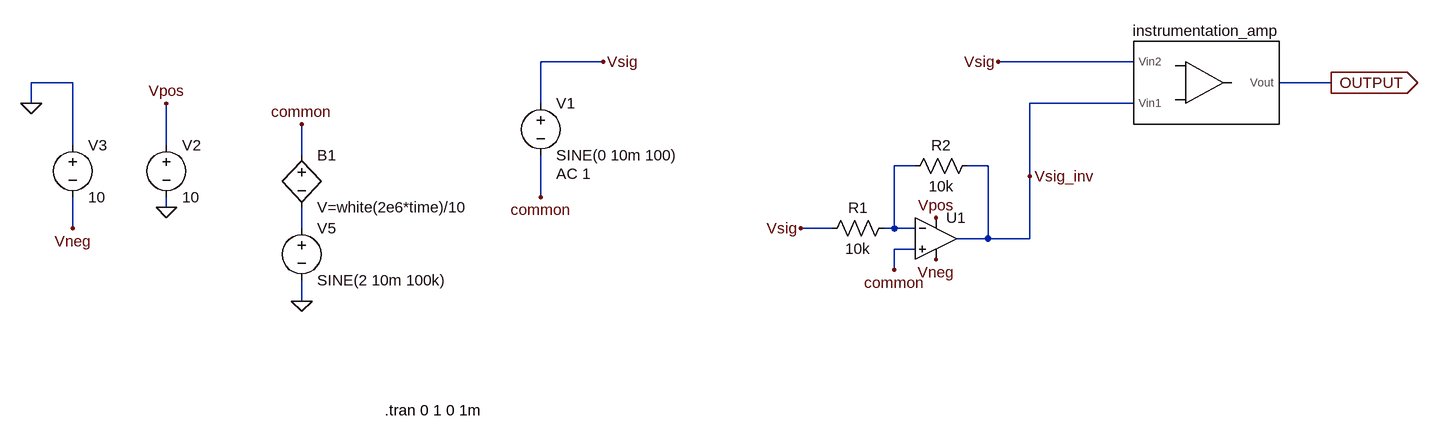
[diagram p0: schematic test_setup.asc]
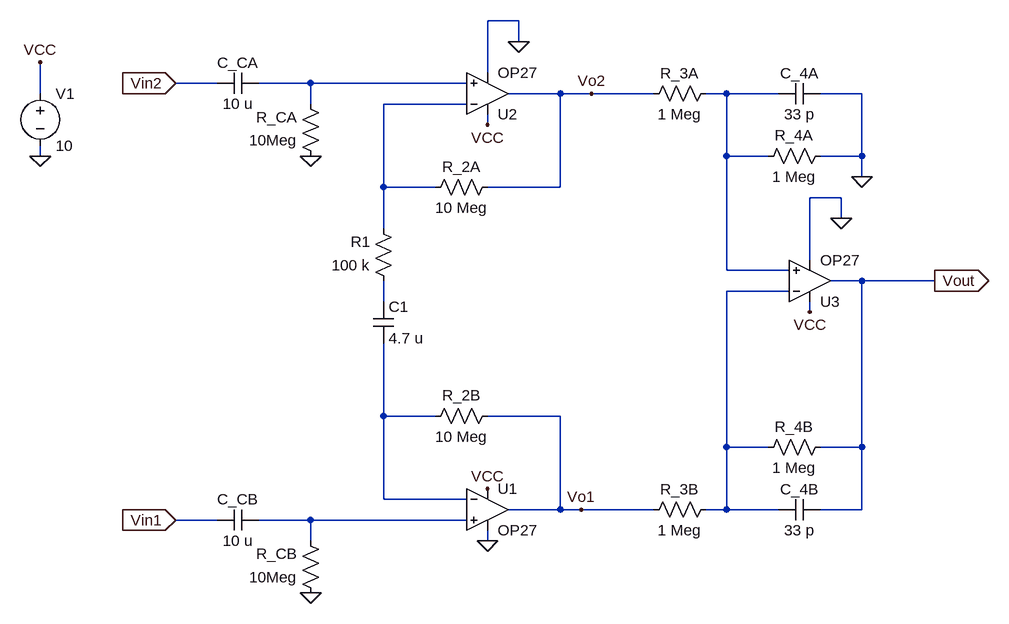
[diagram p1: sub-circuit instrumentation_amplifier.asc]
test_setup.asc, the LTspice schematic file:
Version 4.1
SHEET 1 1020 680
WIRE -592 16 -688 16
WIRE 224 16 16 16
WIRE -1408 48 -1472 48
WIRE 528 48 448 48
WIRE -1472 80 -1472 48
WIRE -688 80 -688 16
WIRE 224 80 64 80
WIRE -1408 144 -1408 48
WIRE -1264 144 -1264 80
WIRE -1056 160 -1056 112
WIRE -112 176 -144 176
WIRE 0 176 -32 176
WIRE 64 192 64 80
WIRE -688 224 -688 160
WIRE -1264 240 -1264 224
WIRE -1408 272 -1408 224
WIRE -1056 272 -1056 240
WIRE -240 272 -288 272
WIRE -144 272 -144 176
WIRE -144 272 -160 272
WIRE -112 272 -144 272
WIRE 0 288 0 176
WIRE 0 288 -48 288
WIRE 64 288 64 192
WIRE 64 288 0 288
WIRE -112 304 -144 304
WIRE -144 336 -144 304
WIRE -1056 384 -1056 352
FLAG -592 16 Vsig
FLAG -288 272 Vsig
FLAG 16 16 Vsig
FLAG -1264 80 Vpos
FLAG -80 256 Vpos
FLAG -1264 240 0
FLAG -1472 80 0
FLAG -1408 272 Vneg
FLAG -80 320 Vneg
FLAG 528 48 OUTPUT
IOPIN 528 48 Out
FLAG 64 192 Vsig_inv
FLAG -1056 112 common
FLAG -688 224 common
FLAG -144 336 common
FLAG -1056 384 0
SYMBOL instrumentation_amplifier 128 -64 R0
SYMATTR InstName instrumentation_amp
SYMBOL voltage -688 64 R0
WINDOW 123 24 124 Left 2
WINDOW 39 0 0 Left 0
SYMATTR InstName V1
SYMATTR Value SINE(0 10m 100)
SYMATTR Value2 AC 1
SYMBOL res -144 256 R90
WINDOW 0 0 56 VBottom 2
WINDOW 3 32 56 VTop 2
SYMATTR InstName R1
SYMATTR Value 10k
SYMBOL res -16 160 R90
WINDOW 0 0 56 VBottom 2
WINDOW 3 32 56 VTop 2
SYMATTR InstName R2
SYMATTR Value 10k
SYMBOL OpAmps\\UniversalOpAmp2 -80 288 R0
SYMATTR InstName U1
SYMBOL voltage -1264 128 R0
SYMATTR InstName V2
SYMATTR Value 10
SYMBOL voltage -1408 128 R0
SYMATTR InstName V3
SYMATTR Value 10
SYMBOL voltage -1056 256 R0
WINDOW 123 0 0 Left 0
WINDOW 39 0 0 Left 0
SYMATTR InstName V5
SYMATTR Value SINE(2 10m 100k)
SYMBOL bv -1056 144 R0
SYMATTR InstName B1
SYMATTR Value V=white(2e6*time)/10
TEXT -928 552 Left 2 !.tran 0 1 0 1m

instrumentation_amplifier.asc, the sub-circuit schematic file:
Version 4.1
SHEET 1 964 692
WIRE 192 -208 144 -208
WIRE 192 -176 192 -208
WIRE 144 -128 144 -208
WIRE -272 -112 -336 -112
WIRE -128 -112 -208 -112
WIRE 112 -112 -128 -112
WIRE -544 -96 -544 -144
WIRE 256 -96 176 -96
WIRE 304 -96 256 -96
WIRE 400 -96 304 -96
WIRE 512 -96 480 -96
WIRE 592 -96 512 -96
WIRE 720 -96 656 -96
WIRE -128 -80 -128 -112
WIRE 112 -80 -16 -80
WIRE 144 -48 144 -64
WIRE -544 0 -544 -16
WIRE 512 0 512 -96
WIRE 576 0 512 0
WIRE 720 0 720 -96
WIRE 720 0 656 0
WIRE 720 32 720 0
WIRE -16 48 -16 -80
WIRE 64 48 -16 48
WIRE 256 48 256 -96
WIRE 256 48 144 48
WIRE 688 64 640 64
WIRE 688 96 688 64
WIRE -16 112 -16 48
WIRE 640 160 640 64
WIRE 512 176 512 0
WIRE 608 176 512 176
WIRE 720 192 672 192
WIRE 832 192 720 192
WIRE 608 208 512 208
WIRE -16 224 -16 192
WIRE 640 240 640 224
WIRE -16 400 -16 288
WIRE 64 400 -16 400
WIRE 256 400 144 400
WIRE 512 448 512 208
WIRE 576 448 512 448
WIRE 720 448 720 192
WIRE 720 448 656 448
WIRE -16 528 -16 400
WIRE 112 528 -16 528
WIRE 256 544 256 400
WIRE 256 544 176 544
WIRE 288 544 256 544
WIRE 400 544 288 544
WIRE 512 544 512 448
WIRE 512 544 480 544
WIRE 592 544 512 544
WIRE 720 544 720 448
WIRE 720 544 656 544
WIRE -272 560 -336 560
WIRE -128 560 -208 560
WIRE 112 560 -128 560
WIRE -128 592 -128 560
WIRE 144 592 144 576
FLAG 192 -176 0
FLAG 144 592 0
FLAG 688 96 0
FLAG -544 0 0
FLAG -544 -144 VCC
FLAG 144 -48 VCC
FLAG 144 512 VCC
FLAG 640 240 VCC
FLAG -128 0 0
FLAG -128 672 0
FLAG 720 32 0
FLAG 304 -96 Vo2
FLAG 288 544 Vo1
FLAG 832 192 Vout
IOPIN 832 192 Out
FLAG -336 -112 Vin2
IOPIN -336 -112 In
FLAG -336 560 Vin1
IOPIN -336 560 In
SYMBOL OpAmps\\OP27 144 480 R0
SYMATTR InstName U1
SYMBOL OpAmps\\OP27 144 -32 M180
SYMATTR InstName U2
SYMBOL OpAmps\\OP27 640 256 M180
SYMATTR InstName U3
SYMBOL res 0 208 R180
WINDOW 0 36 76 Left 2
WINDOW 3 36 40 Left 2
SYMATTR InstName R1
SYMATTR Value 100 k
SYMBOL voltage -544 -112 R0
SYMATTR InstName V1
SYMATTR Value 10
SYMBOL cap -32 224 R0
SYMATTR InstName C1
SYMATTR Value 4.7 u
SYMBOL res 160 32 R90
WINDOW 0 0 56 VBottom 2
WINDOW 3 32 56 VTop 2
SYMATTR InstName R_2A
SYMATTR Value 10 Meg
SYMBOL res 160 384 R90
WINDOW 0 0 56 VBottom 2
WINDOW 3 32 56 VTop 2
SYMATTR InstName R_2B
SYMATTR Value 10 Meg
SYMBOL res 672 -16 R90
WINDOW 0 0 56 VBottom 2
WINDOW 3 32 56 VTop 2
SYMATTR InstName R_4A
SYMATTR Value 1 Meg
SYMBOL res 672 432 R90
WINDOW 0 0 56 VBottom 2
WINDOW 3 32 56 VTop 2
SYMATTR InstName R_4B
SYMATTR Value 1 Meg
SYMBOL res -112 688 R180
WINDOW 0 36 76 Left 2
WINDOW 3 36 40 Left 2
SYMATTR InstName R_CB
SYMATTR Value 10Meg
SYMBOL res -112 16 R180
WINDOW 0 36 76 Left 2
WINDOW 3 36 40 Left 2
SYMATTR InstName R_CA
SYMATTR Value 10Meg
SYMBOL cap -208 -128 R90
WINDOW 0 0 32 VBottom 2
WINDOW 3 32 32 VTop 2
SYMATTR InstName C_CA
SYMATTR Value 10 u
SYMBOL cap -208 544 R90
WINDOW 0 0 32 VBottom 2
WINDOW 3 32 32 VTop 2
SYMATTR InstName C_CB
SYMATTR Value 10 u
SYMBOL res 496 -112 R90
WINDOW 0 0 56 VBottom 2
WINDOW 3 32 56 VTop 2
SYMATTR InstName R_3A
SYMATTR Value 1 Meg
SYMBOL res 496 528 R90
WINDOW 0 0 56 VBottom 2
WINDOW 3 32 56 VTop 2
SYMATTR InstName R_3B
SYMATTR Value 1 Meg
SYMBOL cap 656 -112 R90
WINDOW 0 0 32 VBottom 2
WINDOW 3 32 32 VTop 2
SYMATTR InstName C_4A
SYMATTR Value 33 p
SYMBOL cap 656 528 R90
WINDOW 0 0 32 VBottom 2
WINDOW 3 32 32 VTop 2
SYMATTR InstName C_4B
SYMATTR Value 33 p

The netlist it stands for:
* test_setup.asc
X§instrumentation_amp Vsig_inv Vsig OUTPUT instrumentation_amplifier
V1 Vsig common SINE(0 10m 100) AC 1
R1 N001 Vsig 10k
R2 Vsig_inv N001 10k
X§U1 common N001 Vpos Vneg Vsig_inv level2 Avol=1Meg GBW=10Meg Slew=10Meg Ilimit=25m Rail=0 Vos=0 En=0 Enk=0 In=0 Ink=0 Rin=500Meg  ; pins In+ In- V+ V- OUT
V2 Vpos 0 10
V3 0 Vneg 10
V5 N002 0 SINE(2 10m 100k)
B1 common N002 V=white(2e6*time)/10

* block symbol definitions
.subckt instrumentation_amplifier Vin1 Vin2 Vout
X§U1 N007 N006 VCC 0 Vo1 OP27  ; pins In+ In- V+ V- OUT
X§U2 N001 N003 VCC 0 Vo2 OP27  ; pins In+ In- V+ V- OUT
X§U3 N002 N004 VCC 0 Vout OP27  ; pins In+ In- V+ V- OUT
R1 N005 N003 100 k
V1 VCC 0 10
C1 N005 N006 4.7 u
R_2A Vo2 N003 10 Meg
R_2B Vo1 N006 10 Meg
R_4A 0 N002 1 Meg
R_4B Vout N004 1 Meg
R_CB 0 N007 10Meg
R_CA 0 N001 10Meg
C_CA N001 Vin2 10 u
C_CB N007 Vin1 10 u
R_3A N002 Vo2 1 Meg
R_3B N004 Vo1 1 Meg
C_4A 0 N002 33 p
C_4B Vout N004 33 p
.ends instrumentation_amplifier

.tran 0 1 0 1m
.lib ADI.lib
.lib UniversalOpAmp2.lib
.backanno
.end